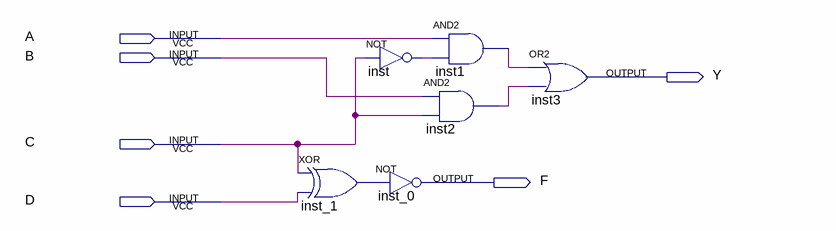
[diagram p0: schematic sheet]
// Quartus schematic Multiplexer_0.bdf as structural Verilog: 6 symbols, 6 pins
module Multiplexer_0 (
  input  A,
  input  B,
  input  C,
  input  D,
  output Y,
  output F
);

  wire inst1_out, inst2_out, inst_1_out, inst_out;

  xor inst_1 (inst_1_out, C, D);
  not inst (inst_out, C);
  not inst_0 (F, inst_1_out);
  and inst1 (inst1_out, A, inst_out);
  and inst2 (inst2_out, B, C);
  or inst3 (Y, inst1_out, inst2_out);
endmodule
